# Altium schematic sheet SEG_pressure gauge_don  V2.5.SchDoc
size A2
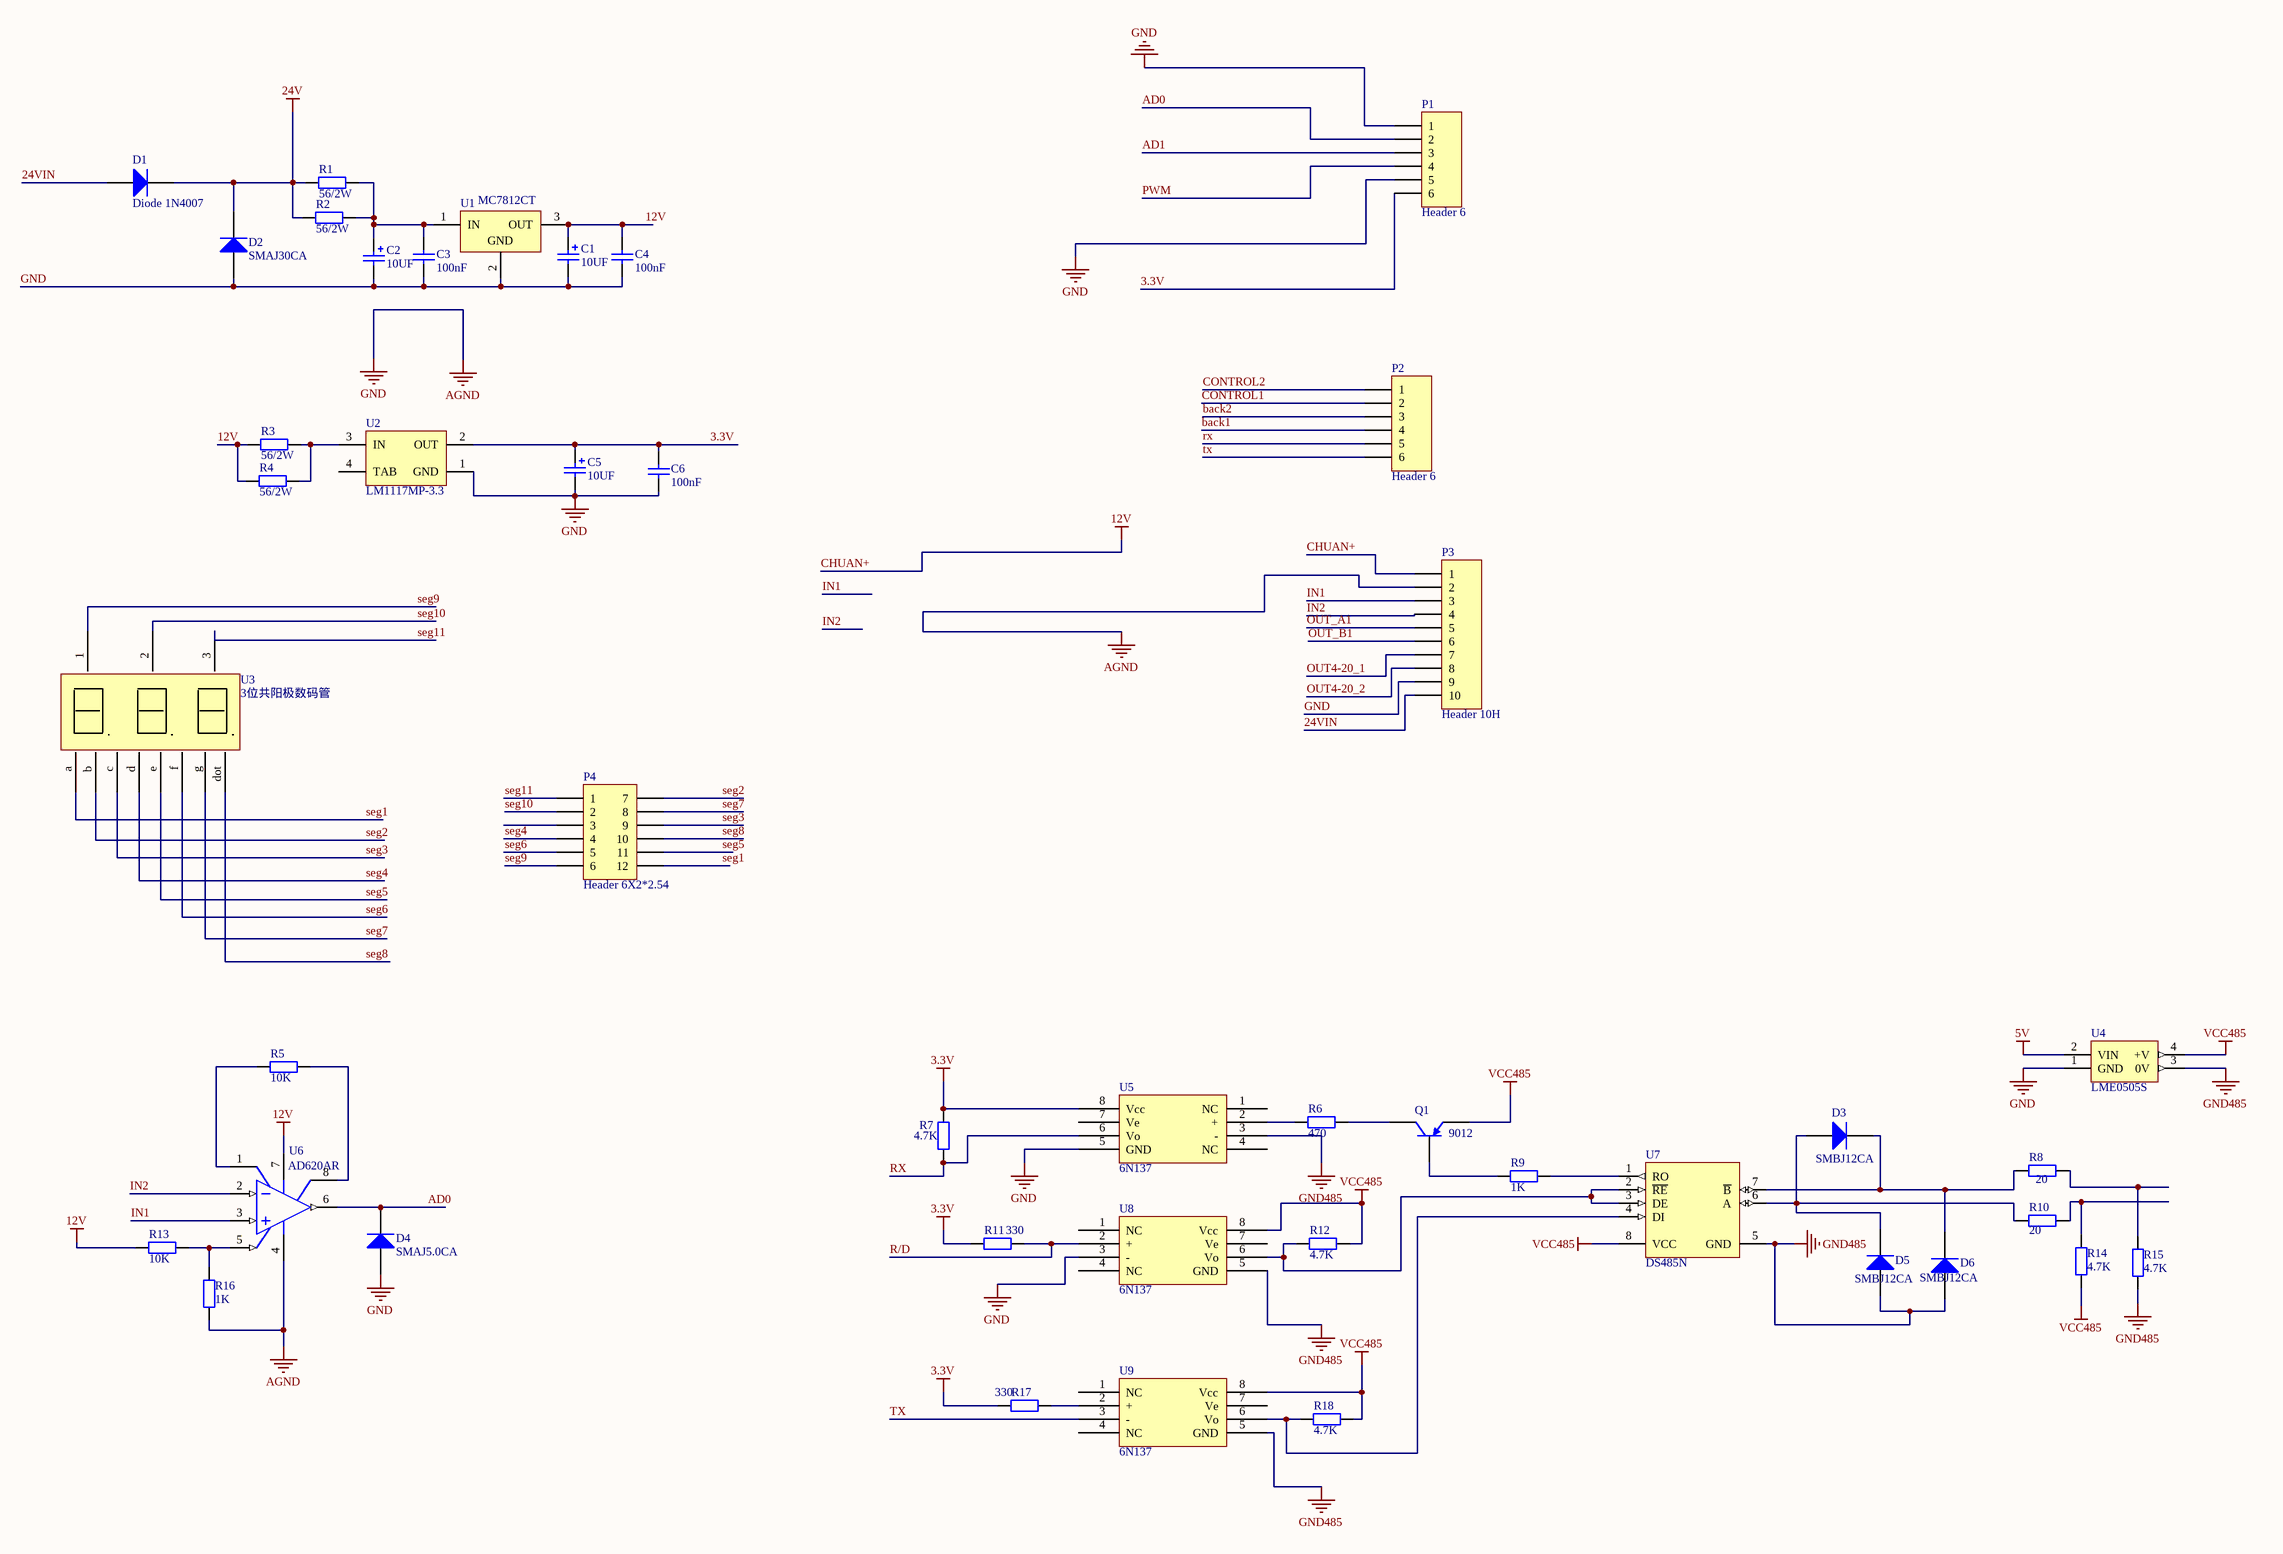
[diagram p0: SEG_pressure gauge_don  V2.5.SchDoc]

## Parts
C1  10uf  [3216]
C2  10uf  [3216]
C3  100nf  [0805_C_Y]
C4  100nf  [0805_C_Y]
C5  10uf  [3216]
C6  100nf  [0805_C_Y]
D1  Diode 1N4007  [DO-214]
D2  SMAJ30CA  [DO-214]
D3  SMBJ12CA  [DSO-C2/X3.3]
D4  SMAJ5.0CA  [DO-214]
D5  SMBJ12CA  [DSO-C2/X3.3]
D6  SMBJ12CA  [DSO-C2/X3.3]
P1  Header 6  [HDR1X6]
P2  Header 6  [HDR1X6]
P3  Header 10H  [HDR1X10H]
P4  Header 6X2*2.54  [HDR2X6_CEN]
Q1  9012  [SOT-23_Y]
R1  56/2W  [1206]
R2  56/2W  [1206]
R3  56/2W  [1206]
R4  56/2W  [1206]
R5  10k  [0805_R_Y]
R6  470  [0805_R_Y]
R7  4.7K  [0805_R_Y]
R8  20  [0805_R_Y]
R9  1K  [0805_R_Y]
R10  20  [0805_R_Y]
R11  330  [0805_R_Y]
R12  4.7K  [0805_R_Y]
R13  10k  [0805_R_Y]
R14  4.7K  [0805_R_Y]
R15  4.7K  [0805_R_Y]
R16  1k  [0805_R_Y]
R17  330  [0805_R_Y]
R18  4.7K  [0805_R_Y]
U1  MC7812CT  [SOT89M]
U2  LM1117MP-3.3  [SOT89M]
U3  3位共阳极数码管  [3位数码管0.56]
U4  LME0505S  [NPSIP4]
U5  6N137  [SO8NB]
U6  AD620AR  [SO-8_Y]
U7  DS485N  [SO8NB]
U8  6N137  [SO8NB]
U9  6N137  [SO8NB]

## Nets
3.3V: C5.1 C6.1 P1.6 R7.2 R11.2 R17.2 U2.2(OUT) U5.8(Vcc)
5V: U4.2(VIN)
12V: C1.1 C4.1 P3.1 R3.1 R4.1 R13.2 U1.3(OUT) U6.7(V+)  [also labelled CHUAN+]
24V: D1.2(K) D2.2(K) R1.1 R2.1
GND: C1.2 C2.2 C3.2 C4.2 C5.2 C6.2 D2.1(A) D4.1(A) P1.1 P1.5 P3.2 P3.9 R16.1 U1.2(GND) U2.1(GND) U4.1(GND) U5.5(GND) U6.4(V-) U8.3(-)  [also labelled AGND]
GND485: D5.1(A) D6.1(A) R15.1 U4.3(0V) U5.3(-) U7.5(GND) U8.5(GND) U9.5(GND)
VCC485: Q1.1(E) R12.2 R14.1 R18.2 U4.4(+V) U7.8(VCC) U8.8(Vcc) U9.8(Vcc)
24VIN: D1.1(A) P3.10
AD0: D4.2(K) P1.2 U6.6(OUT)
AD1: P1.3
back1: P2.4
back2: P2.3
CONTROL1: P2.2
CONTROL2: P2.1
IN1: P3.3 U6.3(+IN)
IN2: P3.4 U6.2(-IN)
OUT4-20_1: P3.7
OUT4-20_2: P3.8
OUT_A1: P3.5
OUT_B1: P3.6
PWM: P1.4
R/D: R11.1 U8.2(+)
rx: P2.5 R7.1 U5.6(Vo)
seg1: P4.12 U3.a
seg2: P4.7 U3.b
seg3: P4.9 U3.c
seg4: P4.4 U3.d
seg5: P4.11 U3.e
seg6: P4.5 U3.f
seg7: P4.8 U3.g
seg8: P4.10 U3.dot
seg9: P4.6 U3.1
seg10: P4.2 U3.2
seg11: P4.1 U3.3
tx: P2.6 U9.3(-)
NetC2_1: C2.1 C3.1 R1.2 R2.2 U1.1(IN)
NetD3_1: D3.1(A) D5.2(K) R10.2 U7.6(A)
NetD3_2: D3.2(K) D6.2(K) R8.2 U7.7(~{B})
NetQ1_2: Q1.2(B) R9.1
NetQ1_3: Q1.3(C) R6.2
NetR3_2: R3.2 R4.2 U2.3(IN)
NetR5_1: R5.1 U6.1(RG)
NetR5_2: R5.2 U6.8(RG)
NetR6_1: R6.1 U5.2(+)
NetR8_1: R8.1 R15.2
NetR9_2: R9.2 U7.1(RO)
NetR10_1: R10.1 R14.2
NetR12_1: R12.1 U7.2(~{RE}) U7.3(DE) U8.6(Vo)
NetR13_1: R13.1 R16.2 U6.5(REF)
NetR17_1: R17.1 U9.2(+)
NetR18_1: R18.1 U7.4(DI) U9.6(Vo)

Not connected (* = marked no-connect by the designer): P4 3; U2 4(TAB); U5 1(NC) 4(NC) 7(Ve); U8 1(NC) 4(NC) 7(Ve); U9 1(NC) 4(NC) 7(Ve)

## Library data of the parts
C1 C2 C5 = Cap Pol2: Polarized Capacitor (Axial); Published: 8-Jun-2000; LatestRevisionDate: 17-Jul-2002; LatestRevisionNote: Re-released for DXP Platform.; PackageReference: POLAR0.8; Publisher: Altium Limited; Value: 10UF
C3 C4 C6 = Cap: Capacitor; Published: 8-Jun-2000; LatestRevisionDate: 17-Jul-2002; LatestRevisionNote: Re-released for DXP Platform.; PackageReference: RAD-0.3; Publisher: Altium Limited; Value: 100nF
D1 = Diode 1N4007: 1 Amp General Purpose Rectifier; Published: 8-Jun-2000; LatestRevisionDate: 17-Jul-2002; LatestRevisionNote: Re-released for DXP Platform.; DatasheetVersion: 1998; PackageVersion: Aug-1999; PackageReference: DO-41; Publisher: Altium Limited; Code_JEDEC: DO-204-AL; ComponentLink1Description: Manufacturer Link; ComponentLink1URL: http://www.fairchildsemi.com/; ComponentLink2Description: Datasheet; ComponentLink2URL: http://www.fairchildsemi.com/ds/1N%2F1N4001.pdf
D2 D4 = Diode 1N5402: 3 Amp General Purpose Rectifier; Published: 8-Jun-2000; LatestRevisionDate: 17-Jul-2002; LatestRevisionNote: Re-released for DXP Platform.; DatasheetVersion: 1998; PackageVersion: Aug-1999; PackageReference: DO-201AD; Publisher: Altium Limited; ComponentLink1Description: Manufacturer Link; ComponentLink1URL: http://www.fairchildsemi.com/; ComponentLink2Description: Datasheet; ComponentLink2URL: http://www.fairchildsemi.com/ds/1N%2F1N5400.pdf
D3 D5 D6 = Diode: Default Diode; Published: 8-Jun-2000; LatestRevisionDate: 17-Jul-2002; LatestRevisionNote: Re-released for DXP Platform.; PackageVersion: Sep-1996; PackageReference: SMC; Publisher: Altium Limited; Code_JEDEC: DO-214-AB
P1 P2 = Header 6: Header, 6-Pin; LatestRevisionDate: 17-Jul-2002; LatestRevisionNote: Re-released for DXP Platform.; Publisher: Altium Limited
P3 = Header 10H: Header, 10-Pin, Right Angle; LatestRevisionDate: 17-Jul-2002; LatestRevisionNote: Re-released for DXP Platform.; Publisher: Altium Limited
P4 = Header 6X2A: Header, 6-Pin, Dual row; LatestRevisionDate: 17-Jul-2002; LatestRevisionNote: Re-released for DXP Platform.; Publisher: Altium Limited
Q1 = 2N3906: PNP General Purpose Amplifier; Published: 8-Jun-2000; LatestRevisionDate: 15-Jan-2003; LatestRevisionNote: PCB Footprint 'BCY-W3/D4.7' replaced; DatasheetVersion: 1997; PackageVersion: Sep-1998; PackageReference: TO-92A; Publisher: Altium Limited; Code_JEDEC: TO-92A; ComponentLink1Description: Manufacturer Link; ComponentLink1URL: http://www.fairchildsemi.com/; ComponentLink2Description: Datasheet; ComponentLink2URL: http://www.fairchildsemi.com/ds/2N%2F2N3906.pdf
R1-R5 R7-R17 = Res2: Resistor; Published: 8-Jun-2000; LatestRevisionDate: 17-Jul-2002; LatestRevisionNote: Re-released for DXP Platform.; PackageReference: AXIAL-0.4; Publisher: Altium Limited
  R1-R4: Value: 56/2W
  R5 R13: Value: 10K
  R7 R12 R14 R15: Value: 4.7K
  R8 R10: Value: 20
  R9 R16: Value: 1K
  R11 R17: Value: 330
R6 R18 = Res2: Resistor; Value: 1K; Published: 8-Jun-2000; LatestRevisionDate: 17-Jul-2002; LatestRevisionNote: Re-released for DXP Platform.; PackageReference: AXIAL-0.4; Publisher: Altium Limited
U1 = MC7812CT: Three-Terminal Positive Voltage Regulator; Note: Heatsink surface is connected to Pin 2; Published: 15-Apr-2002; DatasheetVersion: 1997; PackageVersion: 1997; PackageReference: 221A-06; Publisher: Altium Limited; PackageDescription: TO, Thru-Hole, Vertical, Heatsink Mounted; 3 In-Line Leads; Pitch 2.54 mm; Code_JEDEC: TO-262-AA; ComponentLink1Description: Manufacturer Link; ComponentLink1URL: http://www.onsemi.com/site/products/taxonomy/0,4438,503,00.html; ComponentLink2Description: Datasheet; ComponentLink2URL: http://www.onsemi.com/pub/Collateral/MC7800-D.PDF
U2 = LM1117MP-3.3: 800mA Low-Dropout Linear Regulator; Manufacturer: National Semiconductor; CompType: LDO IC; PackageTopMarking: XYTT*N05A; PowerWise: N; Published: 4-Dec-2008; DatasheetVersion: Apr-2006; PackageVersion: revB, Apr-2003; PackageReference: MP04A; Publisher: Altium Limited; PackageDescription: Molded SOT-223, 6.50 x 3.56 x 1.6mm Body, 4 Lead, 2.3mm Pitch; PartNumber: LM1117MP-3.3; RoHS: O; PinCount: 4; DigiKeyPartNumber: LM1117MP-3.3CT-ND; Code_JEDEC: TO-261-AA; Code_IPC: SOT223-4; ComponentLink1Description: LM1117 Datasheet; ComponentLink1URL: http://www.national.com/ds/LM/LM1117.pdf; ComponentLink2Description: LM1117 Web Page; ComponentLink2URL: http://www.national.com/pf/LM/LM1117.html; ComponentLink3Description: MP04A Package Page; ComponentLink3URL: http://www.national.com/packaging/folders/mp04a.html
U4 = LME0505S: Isolated 250mW Single Output; Published: 8-Jun-2000; LatestRevisionDate: 17-Jul-2002; LatestRevisionNote: Re-released for DXP Platform.; DatasheetVersion: Jul-1996; PackageVersion: 1996; PackageReference: NPSIP4; Publisher: Altium Limited; PackageDescription: SIP; 4 Leads; Body 10 x 11.5 x 6 mm (typ); Pitch 2.54 mm; ComponentLink1Description: Manufacturer Link; ComponentLink1URL: http://www.dc-dc.com/; ComponentLink2Description: Datasheet; ComponentLink2URL: http://www.cd4power.com/data/power/ncl/ndc_lme_4.pdf
U5 U8 U9 = 6N137: 高速光耦
U6 = AD620AR: Low-Cost, Low-Power Instrumentation Amplifier; Published: 8-Jun-2000; LatestRevisionDate: 13-Apr-2006; LatestRevisionNote: IPC-7351 Footprint Added.; DatasheetVersion: REV.D 1998; PackageVersion: 1998; PackageReference: R-8D; Publisher: Altium Limited; PackageDescription: 8-Pin Narrow Body Small Outline Integrated Circuit 1.27 mm Pitch; ComponentLink1Description: Manufacturer Link; ComponentLink1URL: http://www.analog.com/en/prod/0%2C2877%2CAD620%2C00.html; ComponentLink2Description: Datasheet; ComponentLink2URL: http://www.analog.com/UploadedFiles/Data_Sheets/897653854AD620_g.pdf
U7 = DS485N: Low-Power RS-485/RS-422 Multipoint Transceiver; Manufacturer: National Semiconductor; CompType: Interface IC; PackageTopMarking: NSUZXYTT*DS485*N; PowerWise: N; Published: 4-Dec-2008; DatasheetVersion: Jul-1998; PackageVersion: revG, May-2006; PackageReference: N08E; Publisher: Altium Limited; PackageDescription: MDIP, .365 x .250 x .130in, 8 Lead, .100in Pitch; PartNumber: DS485N; RoHS: Y; PinCount: 8; DigiKeyPartNumber: DS485N-ND; Code_JEDEC: MS-001-BA; ComponentLink1Description: DS485 Datasheet; ComponentLink1URL: http://www.national.com/ds/DS/DS485.pdf; ComponentLink2Description: DS485 Web Page; ComponentLink2URL: http://www.national.com/pf/DS/DS485.html; ComponentLink3Description: N08E Package Page; ComponentLink3URL: http://www.national.com/packaging/folders/n08e.html